# EasyEDA schematic GYROCON F4 easy eda schematics.json
TITLE: GYROCON F4; REV: 1.0; Date: 2022-06-30; Sheet: 1/1; Drawn By: Darije caic; Company: MELTEDGRO FC
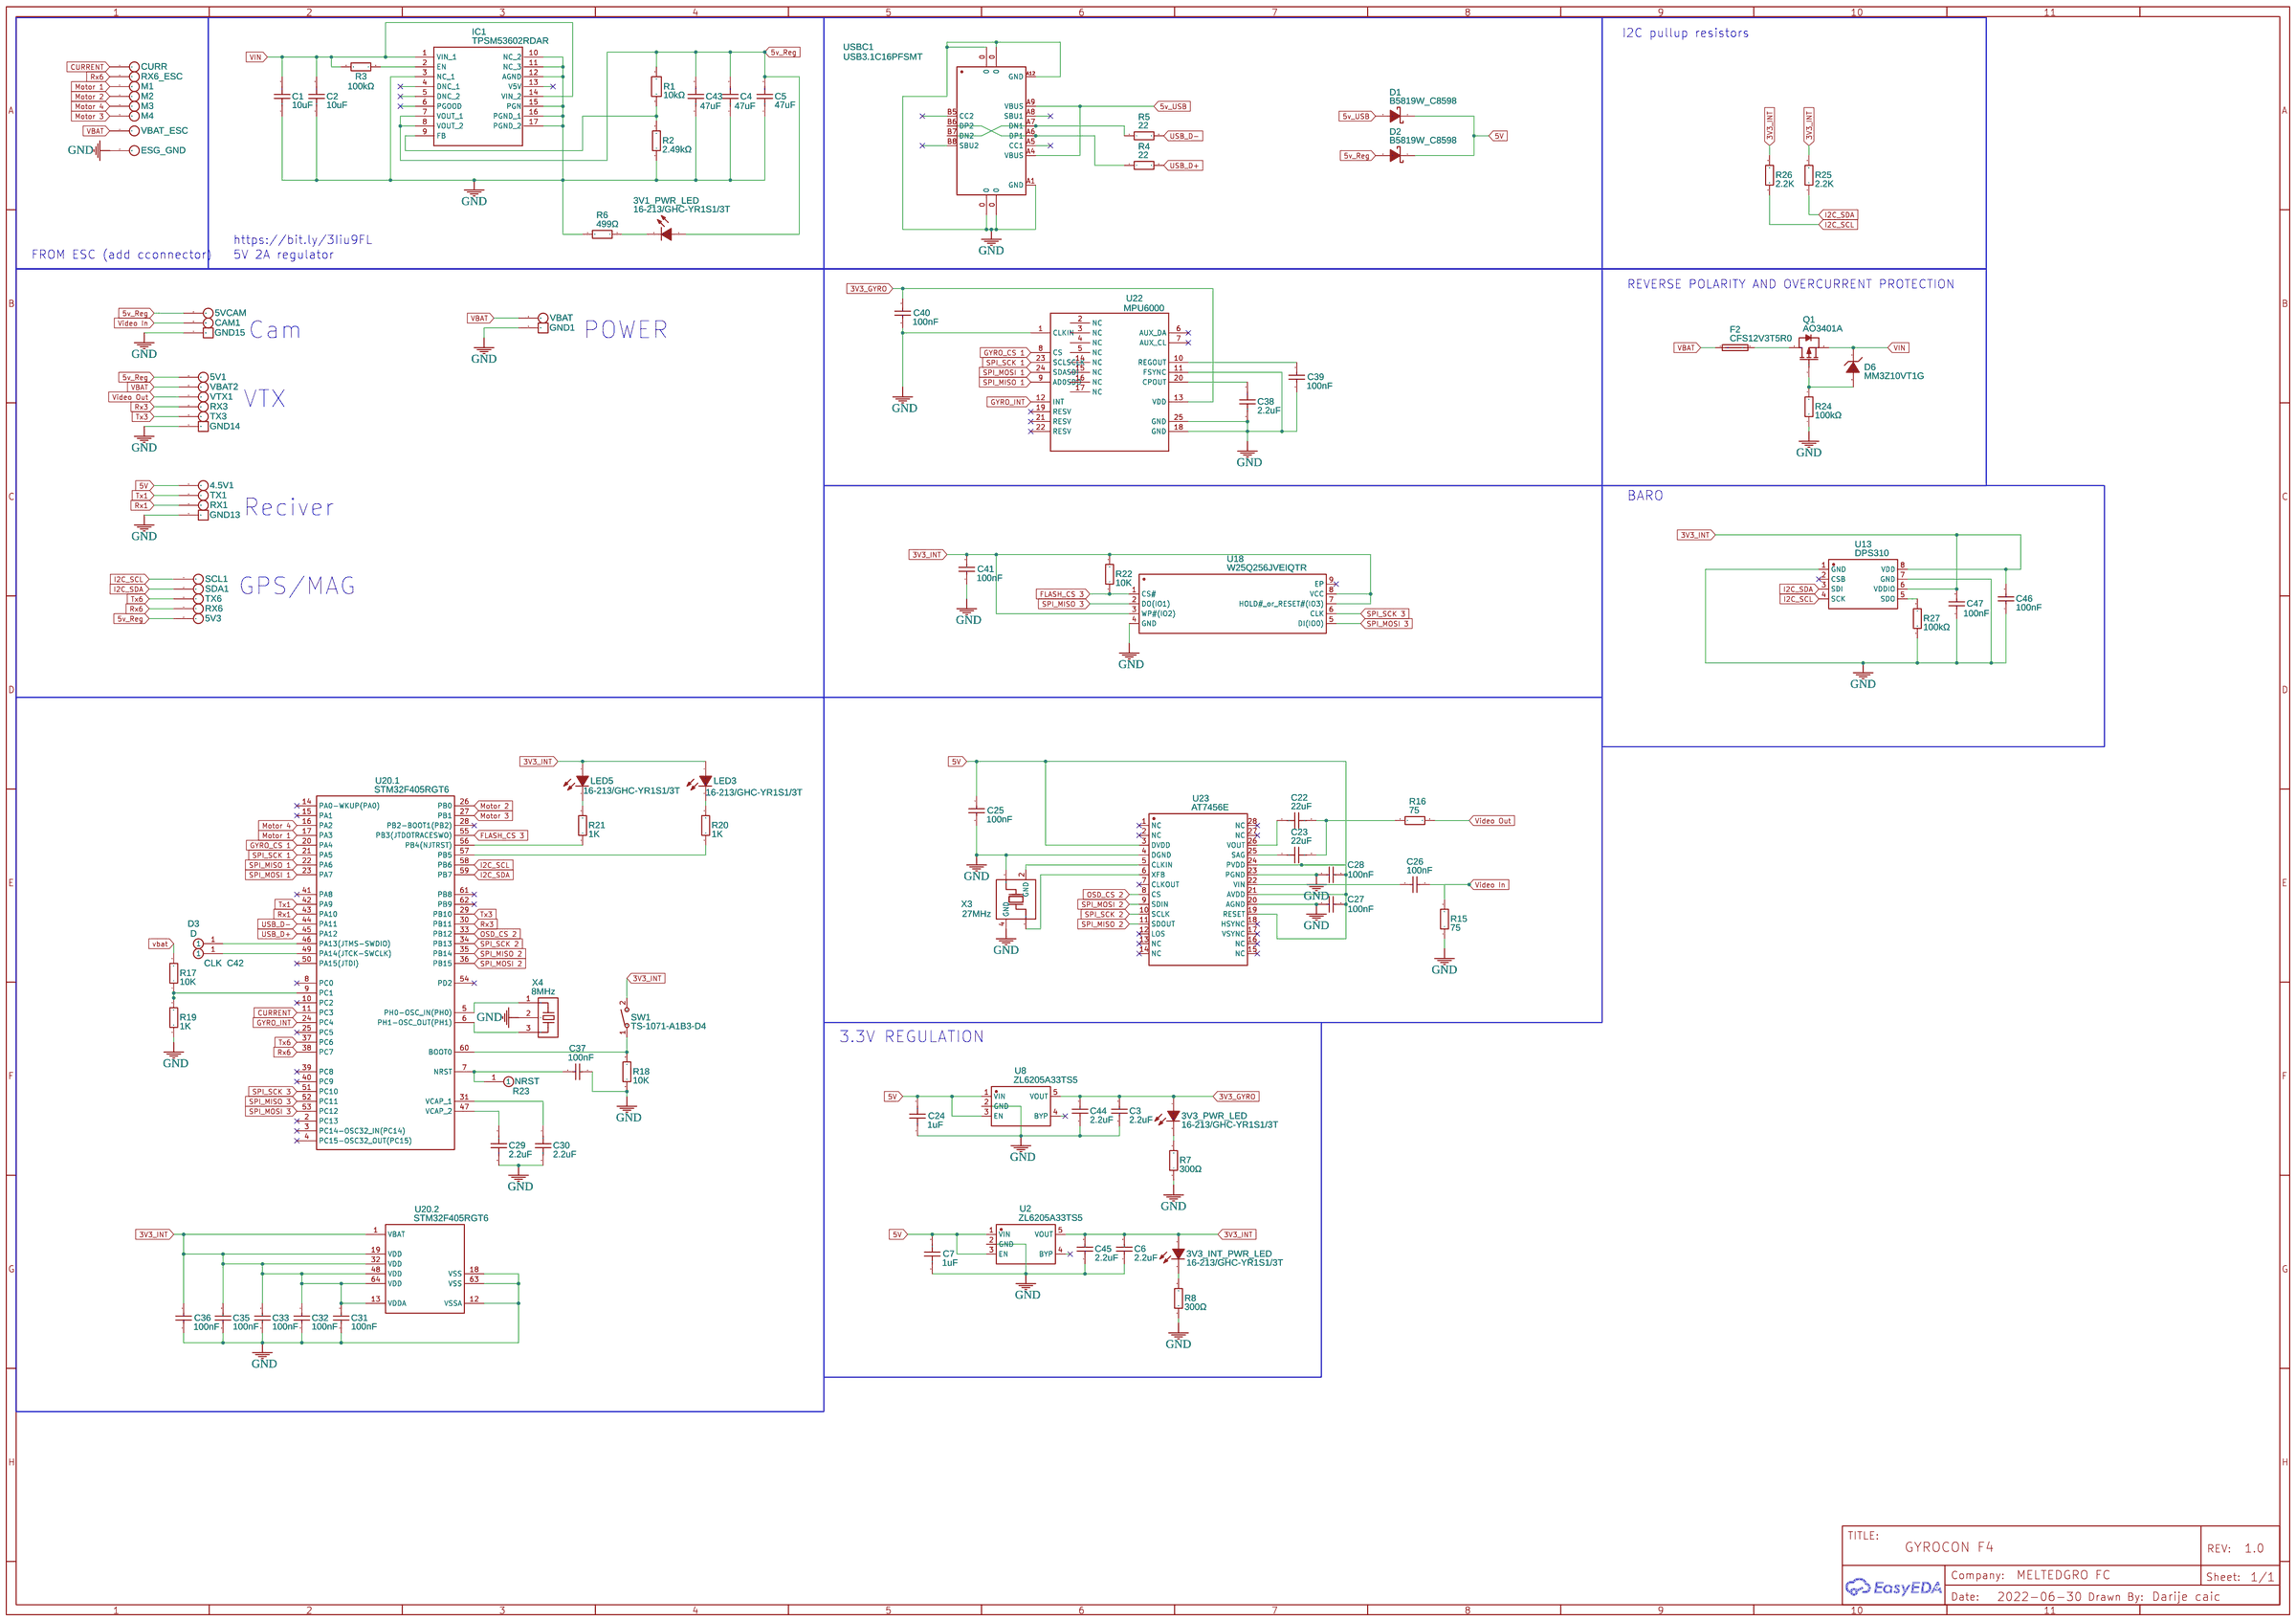
[diagram p0: schematic sheet]

## Parts
3V1_PWR_LED  16-213/GHC-YR1S1/3T  [LED0402-R-RD]
3V3_INT_PWR_LED  16-213/GHC-YR1S1/3T  [LED0402-R-RD]
3V3_PWR_LED  16-213/GHC-YR1S1/3T  [LED0402-R-RD]
4.5V1  ROUND SOLDER PADS WITH HOLE 1.5MM X 2.5MM COPY  [ROUND SOLDER PADS WITH HOLE 1MM X 1.75MM]
5V1  ROUND SOLDER PADS WITH HOLE 1.5MM X 2.5MM COPY  [ROUND SOLDER PADS WITH HOLE 1MM X 1.75MM]
5V3  ROUND SOLDER PADS WITH HOLE 1.5MM X 2.5MM COPY  [ROUND SOLDER PADS WITH HOLE 1MM X 1.75MM]
5VCAM  ROUND SOLDER PADS WITH HOLE 1.5MM X 2.5MM COPY  [ROUND SOLDER PADS WITH HOLE 1MM X 1.75MM]
C1  10uF  [C1210]
C2  10uF  [C1210]
C3  2.2uF  [C0603]
C4  47uF  [C1210]
C5  47uF  [C1210]
C6  2.2uF  [C0603]
C7  1uF  [C0402]
C22  22uF  [C0603]
C23  22uF  [C0603]
C24  1uF  [C0402]
C25  100nF  [C0402]
C26  100nF  [C0402]
C27  100nF  [C0402]
C28  100nF  [C0402]
C29  2.2uF  [C0402]
C30  2.2uF  [C0402]
C31  100nF  [C0402]
C32  100nF  [C0402]
C33  100nF  [C0402]
C35  100nF  [C0402]
C36  100nF  [C0402]
C37  100nF  [C0402]
C38  2.2uF  [C0402]
C39  100nF  [C0402]
C40  100nF  [C0402]
C41  100nF  [C0402]
C42  CLK  [TEST PAD]
C43  47uF  [C1210]
C44  2.2uF  [C0603]
C45  2.2uF  [C0603]
C46  100nF  [C0402]
C47  100nF  [C0402]
CAM1  ROUND SOLDER PADS WITH HOLE 1.5MM X 2.5MM COPY  [ROUND SOLDER PADS WITH HOLE 1MM X 1.75MM]
CURR  ROUND SOLDER PADS WITH HOLE 1.5MM X 2.5MM COPY  [ROUND SOLDER PADS WITH HOLE 1MM X 1.75MM]
D1  B5819W_C8598  [SOD-123_L2.7-W1.6-LS3.7-RD-1]
D2  B5819W_C8598  [SOD-123_L2.7-W1.6-LS3.7-RD-1]
D3  D  [TEST PAD]
D6  MM3Z10VT1G  [SOD-323_L1.8-W1.3-LS2.5-RD]
ESG_GND  ROUND SOLDER PADS WITH HOLE 1.5MM X 2.5MM COPY  [ROUND SOLDER PADS WITH HOLE 1MM X 1.75MM]
F2  CFS12V3T5R0  [F1206]
GND1  RECTANGLE SOLDER PADS WITH HOLE 1.5MM X 2.5MM  [RECTANGLE SOLDER PADS WITH HOLE 1.25MM X 1.75MM]
GND13  RECTANGLE SOLDER PADS WITH HOLE 1.5MM X 2.5MM  [RECTANGLE SOLDER PADS WITH HOLE 1.25MM X 1.75MM]
GND14  RECTANGLE SOLDER PADS WITH HOLE 1.5MM X 2.5MM  [RECTANGLE SOLDER PADS WITH HOLE 1.25MM X 1.75MM]
GND15  RECTANGLE SOLDER PADS WITH HOLE 1.5MM X 2.5MM  [RECTANGLE SOLDER PADS WITH HOLE 1.25MM X 1.75MM]
IC1  TPSM53602RDAR  [TPSM53604RDAR]
LED3  16-213/GHC-YR1S1/3T  [LED0402-R-RD]
LED5  16-213/GHC-YR1S1/3T  [LED0402-R-RD]
M1  ROUND SOLDER PADS WITH HOLE 1.5MM X 2.5MM COPY  [ROUND SOLDER PADS WITH HOLE 1MM X 1.75MM]
M2  ROUND SOLDER PADS WITH HOLE 1.5MM X 2.5MM COPY  [ROUND SOLDER PADS WITH HOLE 1MM X 1.75MM]
M3  ROUND SOLDER PADS WITH HOLE 1.5MM X 2.5MM COPY  [ROUND SOLDER PADS WITH HOLE 1MM X 1.75MM]
M4  ROUND SOLDER PADS WITH HOLE 1.5MM X 2.5MM COPY  [ROUND SOLDER PADS WITH HOLE 1MM X 1.75MM]
Q1  AO3401A  [SOT-23_L2.9-W1.3-P0.95-LS2.4-BR]
R1  10kΩ  [R0402]
R2  2.49kΩ  [R0603]
R3  100kΩ  [R0402]
R4  22  [R0402]
R5  22  [R0402]
R6  499Ω  [R0402]
R7  300Ω  [R0402]
R8  300Ω  [R0402]
R15  75  [R0402]
R16  75  [R0402]
R17  10K  [R0402]
R18  10K  [R0402]
R19  1K  [R0402]
R20  1K  [R0402]
R21  1K  [R0402]
R22  10K  [R0402]
R23  NRST  [TEST PAD]
R24  100kΩ  [R0402]
R25  2.2K  [R0402]
R26  2.2K  [R0402]
R27  100kΩ  [R0402]
RX1  ROUND SOLDER PADS WITH HOLE 1.5MM X 2.5MM COPY  [ROUND SOLDER PADS WITH HOLE 1MM X 1.75MM]
RX3  ROUND SOLDER PADS WITH HOLE 1.5MM X 2.5MM COPY  [ROUND SOLDER PADS WITH HOLE 1MM X 1.75MM]
RX6  ROUND SOLDER PADS WITH HOLE 1.5MM X 2.5MM COPY  [ROUND SOLDER PADS WITH HOLE 1MM X 1.75MM]
RX6_ESC  ROUND SOLDER PADS WITH HOLE 1.5MM X 2.5MM COPY  [ROUND SOLDER PADS WITH HOLE 1MM X 1.75MM]
SCL1  ROUND SOLDER PADS WITH HOLE 1.5MM X 2.5MM COPY  [ROUND SOLDER PADS WITH HOLE 1MM X 1.75MM]
SDA1  ROUND SOLDER PADS WITH HOLE 1.5MM X 2.5MM COPY  [ROUND SOLDER PADS WITH HOLE 1MM X 1.75MM]
SW1  TS-1071-A1B3-D4  [KEY-SMD_L4.0-W2.9-LS4.8]
TX1  ROUND SOLDER PADS WITH HOLE 1.5MM X 2.5MM COPY  [ROUND SOLDER PADS WITH HOLE 1MM X 1.75MM]
TX3  ROUND SOLDER PADS WITH HOLE 1.5MM X 2.5MM COPY  [ROUND SOLDER PADS WITH HOLE 1MM X 1.75MM]
TX6  ROUND SOLDER PADS WITH HOLE 1.5MM X 2.5MM COPY  [ROUND SOLDER PADS WITH HOLE 1MM X 1.75MM]
U2  ZL6205A33TS5  [TSOT-23-5_L2.9-W1.6-P0.95-LS2.8-BL]
U8  ZL6205A33TS5  [TSOT-23-5_L2.9-W1.6-P0.95-LS2.8-BL]
U13  DPS310  [WLGA-8_L2.5-W2.0-P0.65-TR_DPS422]
U18  W25Q256JVEIQTR  [WSON-8_L8.0-W6.10-P1.27-TL-EP]
U20  STM32F405RGT6  [LQFP-64_L10.0-W10.0-P0.50-LS12.0-BL]  (sections 1,2)
U22  MPU6000  [QFN50P400X400X95-25T265X275N]
U23  AT7456E  [SSOP-28_L10.2-W5.3-P0.65-LS7.8-BL]
USBC1  USB3.1C16PFSMT  [USB-C-SMD_TYPE-C-USB-17]
VBAT  ROUND SOLDER PADS WITH HOLE 1.5MM X 2.5MM COPY  [ROUND SOLDER PADS WITH HOLE 1MM X 1.75MM]
VBAT2  ROUND SOLDER PADS WITH HOLE 1.5MM X 2.5MM COPY  [ROUND SOLDER PADS WITH HOLE 1MM X 1.75MM]
VBAT_ESC  ROUND SOLDER PADS WITH HOLE 1.5MM X 2.5MM COPY  [ROUND SOLDER PADS WITH HOLE 1MM X 1.75MM]
VTX1  ROUND SOLDER PADS WITH HOLE 1.5MM X 2.5MM COPY  [ROUND SOLDER PADS WITH HOLE 1MM X 1.75MM]
X3  27MHz  [OSC-SMD_4P-L3.2-W2.5-BL]
X4  8MHz  [OSC-SMD_3P-L3.2-W1.3-P1.2-L]

## Library data of the parts
3V1_PWR_LED 3V3_INT_PWR_LED 3V3_PWR_LED LED3 LED5 = 16-213/GHC-YR1S1/3T: Supplier: LCSC; Manufacturer: EVERLIGHT; image: //image.lceda.cn/szlcsc/C74338.jpg; Supplier Part: C74338; LCSC Assembly: Yes; SMT Type: Extend
4.5V1 5V1 5V3 5VCAM CAM1 CURR ESG_GND M1-M4 RX1 RX3 RX6 RX6_ESC SCL1 SDA1 TX1 TX3 TX6 VBAT VBAT2 VBAT_ESC VTX1 = ROUND SOLDER PADS WITH HOLE 1.5MM X 2.5MM COPY: Manufacturer Part: solderpad; Contributor: david.marzocca
C1 C2 = GCM32EC71H106KA03L: Supplier: LCSC; Supplier Part: C126612; Manufacturer: Murata Electronics; Contributor: LCSC; JLCPCB Part Class: Extended Part
C3 C6 C44 C45 = CL10A225KO8NNNC: Supplier: LCSC; Manufacturer: SAMSUNG; LCSC Assembly: Yes; Supplier Part: C23630; SMT Type: Basic
C4 C5 C43 = GRM32ER61C476ME15L: Supplier: LCSC; Supplier Part: C412254; Manufacturer: Murata Electronics; Contributor: LCSC; JLCPCB Part Class: Extended Part
C7 C24 = CL05A105KA5NQNC: Supplier: LCSC; Manufacturer: SAMSUNG; LCSC Assembly: Yes; Supplier Part: C52923; SMT Type: Basic
C22 C23 = CL10A226MQ8NRNC: Supplier: LCSC; Manufacturer: SAMSUNG; LCSC Assembly: Yes; Supplier Part: C59461; SMT Type: Basic
C25-C28 C31-C33 C35-C37 C39-C41 C46 C47 = CL05B104KO5NNNC: Supplier: LCSC; Manufacturer: SAMSUNG; LCSC Assembly: Yes; Supplier Part: C1525; SMT Type: Basic
C29 C30 C38 = CL05A225MA5NUNC: Supplier: LCSC; Manufacturer: SAMSUNG; Contributor: LCSC; Supplier Part: C159814; LCSC Assembly: Yes; SMT Type: Extend
C42 D3 R23 = Test Pad: Contributor: Brich
D1 D2 = B5819W_C8598: Supplier: LCSC; Manufacturer: CJ; Manufacturer Part: B5819W; Supplier Part: C8598; JLCPCB Part Class: Basic Part
D6 = MM3Z10VT1G: Supplier: LCSC; Manufacturer: ON; image: //image.lceda.cn/szlcsc/C39057.jpg; Supplier Part: C39057; LCSC Assembly: No; SMT Type: Extend
F2 = CFS12V3T5R0: Supplier: LCSC; Supplier Part: C163128; Manufacturer: TA-I Tech; Contributor: LCSC; LCSC Assembly: No; SMT Type: Extend
GND1 GND13-GND15 = RECTANGLE SOLDER PADS WITH HOLE 1.5MM X 2.5MM: Manufacturer Part: solderpad; Contributor: david.marzocca
IC1 = TPSM53602RDAR: Contributor: Darije caic
Q1 = AO3401A: Supplier: LCSC; Manufacturer: AOS; LCSC Assembly: Yes; image: //image.lceda.cn/szlcsc/C15127.jpg; Supplier Part: C15127; SMT Type: Basic
R1 = CR0402F10K0Q10Z: Supplier: LCSC; Supplier Part: C881209; Manufacturer: Ever Ohms Tech; Contributor: LCSC
R2 = AR03BTCX2491: Supplier: LCSC; Supplier Part: C319797; Manufacturer: Viking Tech; Resistance (Ohms): 2.49K; Contributor: LCSC; JLCPCB Part Class: Extended Part
R3 R24 R27 = AECR0402F100KK9: Supplier: LCSC; Supplier Part: C328296; Manufacturer: ResistorToday; Resistance (Ohms): 100K; Contributor: LCSC; JLCPCB Part Class: Extended Part
R4 R5 = RC0402FR-0722RL: Supplier: LCSC; Manufacturer: YAGEO; Supplier Part: C114765; JLCPCB Part Class: Extended Part; Resistance: 22Ω
R6 = PTFR0402B499RP9: Supplier: LCSC; Supplier Part: C478875; Manufacturer: Resistor.Today; Resistance (Ohms): 499; Contributor: LCSC; JLCPCB Part Class: Extended Part
R7 R8 = 0402WGJ0301TCE: Supplier: LCSC; Manufacturer: UniOhm; Supplier Part: C25159; Resistance (Ohms): 300; JLCPCB Part Class: Extended Part
R15 R16 = 0402WGF750JTCE: Supplier: LCSC; Manufacturer: UniOhm; LCSC Assembly: Yes; Supplier Part: C25133; SMT Type: Basic
R17 R18 R22 = 0402WGF1002TCE: Supplier: LCSC; Manufacturer: UniOhm; LCSC Assembly: Yes; Supplier Part: C25744; SMT Type: Basic
R19-R21 = 0402WGF1001TCE: Supplier: LCSC; Manufacturer: UniOhm; LCSC Assembly: Yes; Supplier Part: C11702; SMT Type: Basic
R25 R26 = 0402WGF2201TCE: Supplier: LCSC; Manufacturer: UniOhm; LCSC Assembly: Yes; Supplier Part: C25879; SMT Type: Basic
SW1 = TS-1071-A1B3-D4: Supplier: LCSC; Supplier Part: C492877; Manufacturer: Yuandi; Contributor: LCSC; JLCPCB Part Class: Extended Part
U2 U8 = ZL6205A33TS5: Supplier: LCSC; Supplier Part: C485900; Manufacturer: ZLG Zhiyuan Elec; Contributor: LCSC; SMT Type: Extend; JLCPCB SMD: Yes
U13 = DPS310: Supplier: LCSC; Supplier Part: C535114; Manufacturer: Infineon(英飞凌); Contributor: LCSC; JLCPCB Part Class: Extended Part
U18 = W25Q256JVEIQTR: Supplier: LCSC; Supplier Part: C97522; Manufacturer: Winbond Elec; Contributor: LCSC; LCSC Assembly: Yes; SMT Type: Extend
U20 = STM32F405RGT6: tags: STM32; Supplier Part: C15742; Supplier: LCSC; Manufacturer: ST; subpart_no: 1; image: http://image.lceda.cn/szlcsc/C15742.jpg
U22 = MPU6000
U23 = AT7456E: Supplier: LCSC; Manufacturer: ZHONGKEWEI; image: //image.lceda.cn/szlcsc/C82351.jpg; Supplier Part: C82351; LCSC Assembly: Yes; SMT Type: Extend
USBC1 = USB3.1C16PFSMT: Supplier: LCSC; Supplier Part: C167321; Manufacturer: LCSC; Contributor: LCSC; JLCPCB Part Class: Extended Part
X3 = M27000J506: Supplier: LCSC; Supplier Part: C280077; Manufacturer: ZheJiang East Crystal Elec; Contributor: LCSC
X4 = CSTCE8M00G52-R0: Supplier: LCSC; Manufacturer: MuRata; Supplier Part: C22549

## Nets
3V3_GYRO: 3V3_PWR_LED.1(A) C3.2 C40.2 C44.2 U8.5(VOUT) U22.13(VDD)
3V3_INT: 3V3_INT_PWR_LED.1(A) C6.2 C31.1 C32.1 C33.1 C35.1 C36.1 C41.2 C45.2 C46.2 C47.2 LED3.1(A) LED5.1(A) R22.2 R25.2 R26.2 SW1.2 U2.5(VOUT) U13.6(VDDIO) U13.8(VDD) U18.3(WP#(IO2)) U18.7(HOLD# or RESET#(IO3)) U18.8(VCC) U20.1(VBAT) U20.13(VDDA) U20.19(VDD) U20.32(VDD) U20.48(VDD) U20.64(VDD)
5V: 4.5V1.1(pad) C7.2 C24.2 C25.1 C27.1 C28.1 D1.1(-) D2.1(-) U2.1(VIN) U2.3(EN) U8.1(VIN) U8.3(EN) U23.3(DVDD) U23.19(RESET) U23.21(AVDD) U23.24(PVDD)
5v_Reg: 3V1_PWR_LED.1(A) 5V1.1(pad) 5V3.1(pad) 5VCAM.1(pad) C4.2 C5.2 C43.2 D2.2(+) IC1.7(VOUT_1) IC1.8(VOUT_2) R1.2
5v_USB: D1.2(+) USBC1.A4(VBUS) USBC1.A9(VBUS)
GND: C1.1 C2.1 C3.1 C4.1 C5.1 C6.1 C7.1 C24.1 C25.2 C27.2 C28.2 C29.2 C30.2 C31.2 C32.2 C33.2 C35.2 C36.2 C37.1 C38.2 C39.1 C40.1 C41.1 C43.1 C44.1 C45.1 C46.1 C47.1 ESG_GND.1(pad) GND1.1(pad) GND13.1(pad) GND14.1(pad) GND15.1(pad) IC1.3(NC_1) IC1.10(NC_2) IC1.11(NC_3) IC1.12(AGND) IC1.15(PGN) IC1.16(PGND_1) IC1.17(PGND_2) R2.1 R6.1 R7.1 R8.1 R15.1 R18.1 R19.1 R24.1 R27.1 U2.2(GND) U8.2(GND) U13.1(GND) U13.7(GND) U18.4(GND) U20.12(VSSA) U20.18(VSS) U20.63(VSS) U22.1(CLKIN) U22.11(FSYNC) U22.18(GND) U22.25(GND) U23.4(DGND) U23.20(AGND) U23.23(PGND) USBC1.0 USBC1.A1(GND) USBC1.A12(GND) X3.3(OSC2) X3.4(GND) X4.2
vbat: R17.2
VBAT: F2.1 VBAT.1(pad) VBAT2.1(pad) VBAT_ESC.1(pad)
VIN: C1.2 C2.2 D6.1(C) IC1.1(VIN) IC1.14(VIN_2) Q1.2(S) R3.1
CURRENT: CURR.1(pad) U20.11(PC3)
FLASH_CS 3: R22.1 U18.1(CS#) U20.55(PB3(JTDOTRACESWO))
GYRO_CS 1: U20.20(PA4) U22.8(CS)
GYRO_INT: U20.24(PC4) U22.12(INT)
I2C_SCL: R26.1 SCL1.1(pad) U13.4(SCK) U20.58(PB6)
I2C_SDA: R25.1 SDA1.1(pad) U13.3(SDI) U20.59(PB7)
Motor 1: M1.1(pad) U20.17(PA3)
Motor 2: M2.1(pad) U20.26(PB0)
Motor 3: M4.1(pad) U20.27(PB1)
Motor 4: M3.1(pad) U20.16(PA2)
OSD_CS 2: U20.33(PB12) U23.8(CS)
Rx1: RX1.1(pad) U20.43(PA10)
Rx3: RX3.1(pad) U20.30(PB11)
Rx6: RX6.1(pad) RX6_ESC.1(pad) U20.38(PC7)
SPI_MISO 1: U20.22(PA6) U22.9(AD0SDO)
SPI_MISO 2: U20.35(PB14) U23.11(SDOUT)
SPI_MISO 3: U18.2(DO(IO1)) U20.52(PC11)
SPI_MOSI 1: U20.23(PA7) U22.24(SDASDI)
SPI_MOSI 2: U20.36(PB15) U23.9(SDIN)
SPI_MOSI 3: U18.5(DI(IO0)) U20.53(PC12)
SPI_SCK 1: U20.21(PA5) U22.23(SCLSCLK)
SPI_SCK 2: U20.34(PB13) U23.10(SCLK)
SPI_SCK 3: U18.6(CLK) U20.51(PC10)
Tx1: TX1.1(pad) U20.42(PA9)
Tx3: TX3.1(pad) U20.29(PB10)
Tx6: TX6.1(pad) U20.37(PC6)
USB_D+: R4.2 U20.45(PA12)
USB_D-: R5.2 U20.44(PA11)
Video In: C26.1 CAM1.1(pad) R15.2
Video Out: R16.2 VTX1.1(pad)
Net-(3V1_PWR_LED-2): 3V1_PWR_LED.2(C) R6.2
Net-(3V3_INT_PWR_LED-2): 3V3_INT_PWR_LED.2(C) R8.2
Net-(3V3_PWR_LED-2): 3V3_PWR_LED.2(C) R7.2
Net-(C22-1): C22.1 U23.26(VOUT)
Net-(C22-2): C22.2 C23.2 R16.1
Net-(C23-1): C23.1 U23.25(SAG)
Net-(C26-2): C26.2 U23.22(VIN)
Net-(C29-1): C29.1 U20.47(VCAP_2)
Net-(C30-1): C30.1 U20.31(VCAP_1)
Net-(C37-2): C37.2 R23.1 U20.7(NRST)
Net-(C38-1): C38.1 U22.20(CPOUT)
Net-(C39-2): C39.2 U22.10(REGOUT)
Net-(C42-1): C42.1 U20.49(PA14(JTCK-SWCLK))
Net-(D3-1): D3.1 U20.46(PA13(JTMS-SWDIO))
Net-(D6-2): D6.2(A) Q1.1(G) R24.2
Net-(F2-2): F2.2 Q1.3(D)
Net-(IC1-2): IC1.2(EN) R3.2
Net-(IC1-9): IC1.9(FB) R1.1 R2.2
Net-(LED3-2): LED3.2(C) R20.2
Net-(LED5-2): LED5.2(C) R21.2
Net-(R4-1): R4.1 USBC1.A6(DP1) USBC1.B6(DP2)
Net-(R5-1): R5.1 USBC1.A7(DN1) USBC1.B7(DN2)
Net-(R17-1): R17.1 R19.2 U20.9(PC1)
Net-(R18-2): R18.2 SW1.1 U20.60(BOOT0)
Net-(R20-1): R20.1 U20.57(PB5)
Net-(R21-1): R21.1 U20.56(PB4(NJTRST))
Net-(R27-2): R27.2 U13.5(SDO)
Net-(U20.1-5): U20.5(PH0-OSC_IN(PH0)) X4.1
Net-(U20.1-6): U20.6(PH1-OSC_OUT(PH1)) X4.3
Net-(U23-5): U23.5(CLKIN) X3.2(GND)
Net-(U23-6): U23.6(XFB) X3.1(OSC1)

Not connected (* = marked no-connect by the designer): IC1 4(DNC_1) 5(DNC_2) 6(PGOOD) 13(V5V); U2 4(BYP); U8 4(BYP); U13 2(CSB)*; U18 9(EP)*; U20 2(PC13)* 3(PC14-OSC32_IN(PC14))* 4(PC15-OSC32_OUT(PC15))* 8(PC0)* 10(PC2)* 14(PA0-WKUP(PA0))* 15(PA1)* 25(PC5)* 28(PB2-BOOT1(PB2))* 39(PC8)* 40(PC9)* 41(PA8)* 50(PA15(JTDI))* 54(PD2)* 61(PB8)* 62(PB9)*; U22 2(NC) 3(NC) 4(NC) 5(NC) 6(AUX_DA)* 7(AUX_CL)* 14(NC) 15(NC) 16(NC) 17(NC) 19(RESV)* 21(RESV)* 22(RESV)*; U23 1(NC)* 2(NC)* 7(CLKOUT)* 12(LOS)* 13(NC)* 14(NC)* 15(NC)* 16(NC)* 17(VSYNC)* 18(HSYNC)* 27(NC)* 28(NC)*; USBC1 A5(CC1) A8(SBU1) B5(CC2) B8(SBU2)

## Notes on the sheet
- I2C pullup resistors
- https://bit.ly/3Iiu9FL
- FROM ESC (add cconnector)
- 5V 2A regulator
- REVERSE POLARITY AND OVERCURRENT PROTECTION
- Cam
- POWER
- VTX
- Reciver
- BARO
- GPS/MAG
- 3.3V REGULATION
